# Altium schematic sheet RTL_mPCIE.SchDoc
size A4
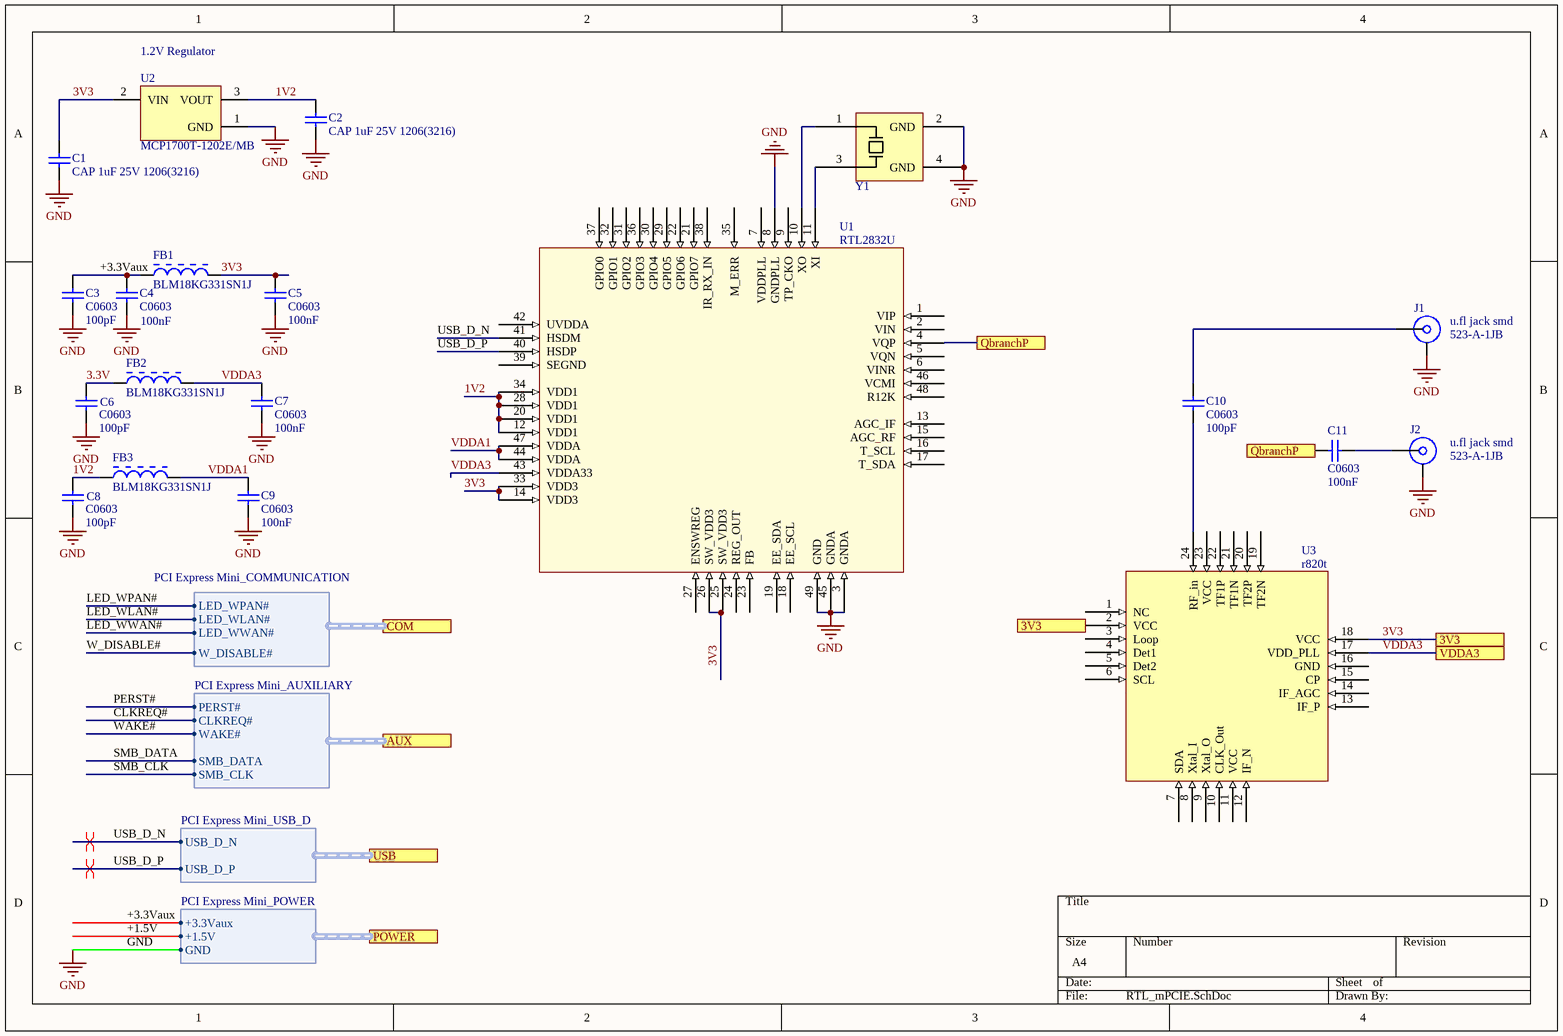
[diagram p0: RTL_mPCIE.SchDoc]

## Parts
C1  CAP 1uF 25V 1206(3216)  [CAPC1206(3216)130_M]
C2  CAP 1uF 25V 1206(3216)  [CAPC1206(3216)130_M]
C3  C0603  value 100pF  [0603]
C4  C0603  value 100nF  [0603]
C5  C0603  value 100nF  [0603]
C6  C0603  value 100pF  [0603]
C7  C0603  value 100nF  [0603]
C8  C0603  value 100pF  [0603]
C9  C0603  value 100nF  [0603]
C10  C0603  value 100pF  [0603]
C11  C0603  value 100nF  [0603]
FB1  BLM18KG331SN1J  [MURA-BLM18PG_KG-B25-CHIP-2_V1]
FB2  BLM18KG331SN1J  [MURA-BLM18PG_KG-B25-CHIP-2_V1]
FB3  BLM18KG331SN1J  [MURA-BLM18PG_KG-B25-CHIP-2_V1]
J1  u.fl jack smd  Supplier Part Number 1: 523-A-1JB  [U.FL jack]
J2  u.fl jack smd  Supplier Part Number 1: 523-A-1JB  [U.FL jack]
U1  RTL2832U  [QFN40P600X600X84_HS-49N]
U2  MCP1700T-1202E/MB  [SOT-89-MB3_N]
U3  r820t  [QFN50P400X400X85_HS-25N_r820t]
Y1  Crystal  [Abracon_ABM11]  (value not drawn)

## Ports
3V3, AUX (harness PCI Express Mini_AUXILIARY), COM (harness PCI Express Mini_COMMUNICATION), POWER (harness PCI Express Mini_POWER), QbranchP, USB (harness PCI Express Mini_USB_D), VDDA3

## Harnesses
PCI Express Mini_COMMUNICATION: LED_WPAN#, LED_WLAN#, LED_WWAN#, W_DISABLE#
PCI Express Mini_AUXILIARY: PERST#, CLKREQ#, WAKE#, SMB_DATA, SMB_CLK
PCI Express Mini_USB_D: USB_D_N, USB_D_P
PCI Express Mini_POWER: +3.3Vaux, +1.5V, GND

## Nets
GND: C1.1 C2.1 C3.1 C4.1 C5.1 C6.1 C7.1 C8.1 C9.1 J1.2 J2.2 U1.3(GNDA) U1.8(GNDPLL) U1.45(GNDA) U1.49(GND) U2.1(GND) Y1.2(GND) Y1.4(GND) ; port POWER.GND
1V2: C2.2 C8.2 FB3.1 U1.12(VDD1) U1.20(VDD1) U1.28(VDD1) U1.34(VDD1) U2.3(VOUT)
3.3V: C6.2 FB2.1
3V3: C1.2 C5.2 FB1.2 U1.14(VDD3) U1.25(SW_VDD3) U1.26(SW_VDD3) U1.33(VDD3) U2.2(VIN) U3.2(VCC) U3.18(VCC) ; port 3V3
+1.5V: port POWER.+1.5V
+3.3Vaux: C3.2 C4.2 FB1.1 ; port POWER.+3.3Vaux
CLKREQ#: port AUX.CLKREQ#
LED_WLAN#: port COM.LED_WLAN#
LED_WPAN#: port COM.LED_WPAN#
LED_WWAN#: port COM.LED_WWAN#
PERST#: port AUX.PERST#
QbranchP: C11.2 U1.4(VQP) ; port QbranchP
SMB_CLK: port AUX.SMB_CLK
SMB_DATA: port AUX.SMB_DATA
USB_D_N: U1.41(HSDM) ; port USB.USB_D_N
USB_D_P: U1.40(HSDP) ; port USB.USB_D_P
VDDA1: C9.2 FB3.2 U1.44(VDDA) U1.47(VDDA)
VDDA3: C7.2 FB2.2 U1.43(VDDA33) U3.17(VDD_PLL) ; port VDDA3
W_DISABLE#: port COM.W_DISABLE#
WAKE#: port AUX.WAKE#
NetC10_1: C10.1 U3.24(RF_in)
NetC10_2: C10.2 J1.1
NetC11_1: C11.1 J2.1
NetU1_10: U1.10(XO) Y1.1(XTAL1)
NetU1_11: U1.11(XI) Y1.3(XTAL2)

Not connected (* = marked no-connect by the designer): U1 1(VIP) 2(VIN) 5(VQN) 6(VINR) 7(VDDPLL) 9(TP_CKO) 13(AGC_IF) 15(AGC_RF) 16(T_SCL) 17(T_SDA) 18(EE_SCL) 19(EE_SDA) 21(GPIO7) 22(GPIO6) 23(FB) 24(REG_OUT) 27(ENSWREG) 29(GPIO5) 30(GPIO4) 31(GPIO2) 32(GPIO1) 35(M_ERR) 36(GPIO3) 37(GPIO0) 38(IR_RX_IN) 39(SEGND) 42(UVDDA) 46(VCMI) 48(R12K); U3 1(NC) 3(Loop) 4(Det1) 5(Det2) 6(SCL) 7(SDA) 8(Xtal_I) 9(Xtal_O) 10(CLK_Out) 11(VCC) 12(IF_N) 13(IF_P) 14(IF_AGC) 15(CP) 16(GND) 19(TF2N) 20(TF2P) 21(TF1N) 22(TF1P) 23(VCC) 25(GND)

## Layout directives
differential pair: USB_D_N, USB_D_P

## Notes on the sheet
- (near U2) 1.2V Regulator

## Library data of the parts
C1 C2 = CMP-1037-04700-1: CAP 1uF 25V ±10% 1206 (3216 Metric) Thickness 1.3mm SMD; Tolerance: Â±10%; Case-Metric: 3216; Case-EIA: 1206; Value: 1uF; Rated Voltage: 25 V; Max Thickness: 1.3 mm; Technology: SMT
C3-C11 = C0603: Ceramic Chip Capacitor - Standard; Note: Footprint corresponds to dimensions for bulk cassette packaging. This case size has tightened tolerances.; Published: 17-Jul-2002; LatestRevisionDate: 19-Mar-2004; LatestRevisionNote: Silkscreen size reduced.; DatasheetDocument: Mar-2001; PackageDocument: Mar-2001; PackageReference: 0603; Publisher: Altium Limited; Code_JEITA: 0603; Code_IPC: 1608 [0603]; ComponentLink1Description: Manufacturer Link; ComponentLink1URL: http://www.kemet.com/; ComponentLink2Description: Datasheet; ComponentLink2URL: http://www.kemet.com/kemet/web/homepage/kechome.nsf/vapubfilesname/F3102TA.pdf/$file/F3102TA.pdf
FB1-FB3 = CMP-0686-00560-6: Chip Ferrite Bead for Power Lines (Low DC Resistance Type), 330 Ohm, 1700 mA, -55 to 125 degC, 1.6 x 0.8 x 0.95 mm SMD, Tape and Reel; Manufacturer: Murata; Impedance (at 100 MHz): 330 Ohm +/- 25%; Rated Current: 1700 mA; DC Resistance: 0.080 Ohm Max.; ComponentLink1URL: http://www.murata.com/; DatasheetVersion: 08/2013; PartNumber: BLM18KG331SN1J; PackageReference: BLM18_H950-2; ComponentLink2Description: Datasheet; Packing: Tape and Reel; ComponentLink1Description: Manufacturer URL; Operating Temperature Range: -55 to 125 degC; ComponentLink3URL: http://www.murata.com/products/catalog/pdf/c31e.pdf; ComponentLink2URL: http://www.murata.com/products/catalog/pdf/c31e.pdf; Mounting Technology: Surface Mount; ComponentLink3Description: Package Specification; PackageDescription: 2-Pin Chip, Body 1.6 x 0.8 mm
J1 J2 = u.fl connector, jack A-1JB: Manufacturer 1: Amphenol / Amphenol RF; Manufacturer Part Number 1: A-1JB; Connector Type: AMC Coaxial; Body Style: Straight Jack; Coaxial Termination: Solder; Impedance: 50ohm; Frequency Max: 6GHz; Supplier 1: Mouser; Stock 1: 19506; Pricing 1: 1=0.65, 10=0.596, 50=0.535, 100=0.51, 1000=0.365, 10000=0.351 (USD); Contact Material: Brass; Contact Plating: Gold; ComponentLink1URL: https://datasheet.ciiva.com/22652/689597-22652949.pdf; ComponentLink1Description: https://datasheet.ciiva.com/22652/689597-22652949.pdf; ComponentLink2URL: https://datasheet.ciiva.com/15172/getdatasheetpartid-168895-15172647.pdf; ComponentLink2Description: https://datasheet.ciiva.com/15172/getdatasheetpartid-168895-15172647.pdf; ComponentLink3URL: https://datasheet.ciiva.com/36526/2036357-36526267.pdf; ComponentLink3Description: https://datasheet.ciiva.com/36526/2036357-36526267.pdf; ComponentLink4URL: https://datasheet.ciiva.com/5175/ca-1jb-38743-5175829.pdf; ComponentLink4Description: https://datasheet.ciiva.com/5175/ca-1jb-38743-5175829.pdf; ComponentLink5URL: https://datasheet.ciiva.com/3132/ca-1jb-3132240.pdf; ComponentLink5Description: https://datasheet.ciiva.com/3132/ca-1jb-3132240.pdf; ComponentLink6URL: https://datasheet.ciiva.com/14157/04614608-14157589.pdf; ComponentLink6Description: https://datasheet.ciiva.com/14157/04614608-14157589.pdf; ComponentLink7URL: https://datasheet.ciiva.com/643/ca-1jb-643532.pdf; ComponentLink7Description: https://datasheet.ciiva.com/643/ca-1jb-643532.pdf; ComponentLink8URL: https://datasheet.ciiva.com/14565/70142555-14565783.pdf; ComponentLink8Description: https://datasheet.ciiva.com/14565/70142555-14565783.pdf; ComponentLink9URL: https://datasheet.ciiva.com/643/ca-1jb-643531.pdf; ComponentLink9Description: https://datasheet.ciiva.com/643/ca-1jb-643531.pdf
U1 = RTL2832U: RTL2832U DVB-T COFDM Demodulator + USB 2.0; Manufacturer: Realtek; Publisher: ftg; ComponentLink1Description: Work on RTL2832U Datasheet; ComponentLink1URL: https://sites.google.com/site/oh2ftg/home/rtl2832u; Mounting: Surface Mount; Package: QFN48
U2 = CMP-0136-00829-1: Low Quiescent Current LDO, 3-Pin SOT-89, Extended Temperature, Tape and Reel; PackageReference: SOT-89-MB3; PackageDescription: 3-Lead Plastic Small Outline Transistor Header (MB) [SOT-89]; DatasheetVersion: revB, Feb-2007; PackageVersion: revBB, Aug-2009; Code_IPC: SOT89
Y1 = XTAL_0024: Crystal, 16MHz, 10pF, 4-SMD (2x1.6); Manufacturer: Abracon; Manufacturer P/N: ABM11-16.000MHZ-D2X-T3; Tolerance: 20ppm; P/N: XTAL_0024; Type: Crystal; Frequency: 16MHz; Load Capacitance: 10pF; Package: 4-SMD (2x1.6); Operating Temp Range: -40C - 85C; Supplier: Digikey; Supplier P/N: 535-12629-1-ND; Supplier Price: 1.04; Datasheet: http://www.abracon.com/Resonators/ABM11.pdf; Date: 3/28/2016; Author: JDS